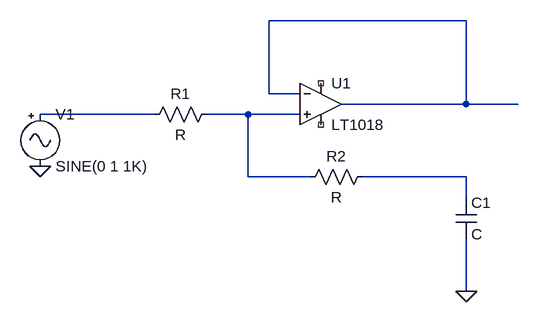
[diagram p0: schematic HW 3 #3.asc]
HW 3 #3.asc, the LTspice schematic file:
Version 4
SHEET 1 880 680
WIRE 544 -32 240 -32
WIRE 240 80 240 -32
WIRE 288 80 240 80
WIRE 544 96 544 -32
WIRE 544 96 352 96
WIRE 624 96 544 96
WIRE 64 112 -112 112
WIRE 208 112 144 112
WIRE 288 112 208 112
WIRE 208 208 208 112
WIRE 304 208 208 208
WIRE 544 208 384 208
WIRE 544 240 544 208
WIRE 544 384 544 304
FLAG 544 384 0
FLAG -112 192 0
SYMBOL res 160 96 R90
WINDOW 0 0 56 VBottom 2
WINDOW 3 32 56 VTop 2
SYMATTR InstName R1
SYMBOL Comparators\\LT1018 320 96 R0
SYMATTR InstName U1
SYMBOL res 400 192 R90
WINDOW 0 0 56 VBottom 2
WINDOW 3 32 56 VTop 2
SYMATTR InstName R2
SYMBOL cap 528 240 R0
SYMATTR InstName C1
SYMBOL Misc\\signal -112 96 R0
SYMATTR InstName V1

The netlist it stands for:
* HW 3 #3.asc
R1 N003 N002 R
XU1 N003 N001 NC_01 NC_02 N001 LT1018  ; pins In+ In- V+ V- OUT
R2 N004 N003 R
C1 N004 0 C
V1 N002 0 SINE(0 1 1K)
.lib LTC1.lib
.backanno
.end